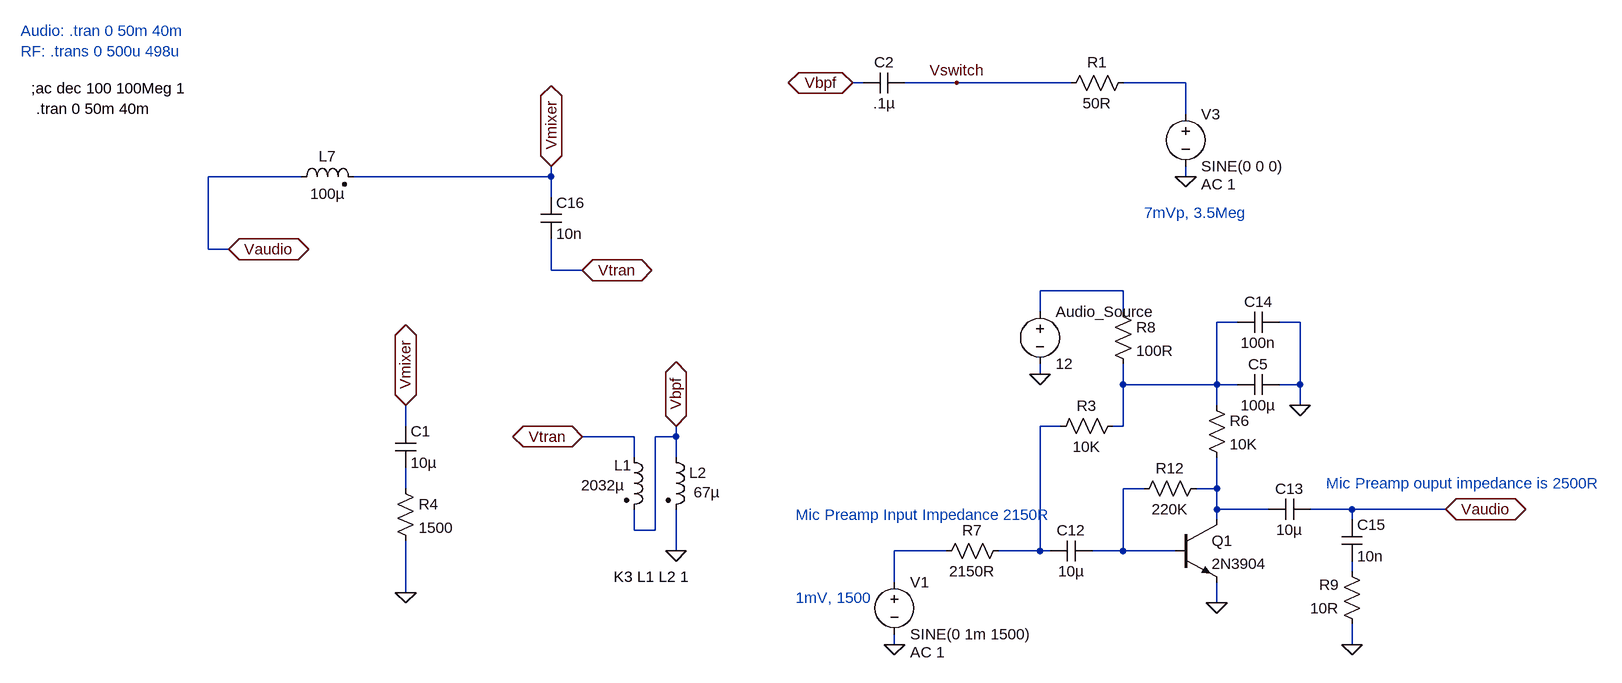
[diagram p0: schematic Receive Chain 80m Passive Switch Test.asc]
Receive Chain 80m Passive Switch Test.asc, the LTspice schematic file:
Version 4
SHEET 1 2548 2196
WIRE 384 112 368 112
WIRE 528 112 448 112
WIRE 704 112 528 112
WIRE 880 112 784 112
WIRE 880 160 880 112
WIRE -480 256 -624 256
WIRE -96 256 -96 240
WIRE -96 256 -400 256
WIRE 880 256 880 240
WIRE -96 288 -96 256
WIRE -624 368 -624 256
WIRE -592 368 -624 368
WIRE -96 400 -96 352
WIRE -48 400 -96 400
WIRE 784 432 656 432
WIRE 656 464 656 432
WIRE 784 464 784 432
WIRE 960 480 928 480
WIRE 1056 480 1024 480
WIRE 656 560 656 544
WIRE 784 576 784 544
WIRE 928 576 928 480
WIRE 928 576 784 576
WIRE 960 576 928 576
WIRE 1056 576 1056 480
WIRE 1056 576 1024 576
WIRE 928 608 928 576
WIRE 1056 608 1056 576
WIRE -320 640 -320 608
WIRE 688 640 656 640
WIRE 784 640 784 576
WIRE 784 640 768 640
WIRE 32 656 -48 656
WIRE 96 656 96 640
WIRE 96 656 64 656
WIRE 32 688 32 656
WIRE 96 688 96 656
WIRE -320 736 -320 704
WIRE 816 736 784 736
WIRE 928 736 928 688
WIRE 928 736 896 736
WIRE 928 768 928 736
WIRE 1008 768 928 768
WIRE 1136 768 1072 768
WIRE 1280 768 1136 768
WIRE 928 784 928 768
WIRE 1136 784 1136 768
WIRE 32 800 32 768
WIRE 64 800 64 656
WIRE 64 800 32 800
WIRE 96 832 96 768
WIRE 512 832 432 832
WIRE 656 832 656 640
WIRE 656 832 592 832
WIRE 672 832 656 832
WIRE 784 832 784 736
WIRE 784 832 736 832
WIRE 864 832 784 832
WIRE 1136 864 1136 848
WIRE 432 880 432 832
WIRE -320 896 -320 816
WIRE 928 912 928 880
WIRE 432 976 432 960
WIRE 1136 976 1136 944
FLAG 96 640 Vbpf
IOPIN 96 640 BiDir
FLAG -320 896 0
FLAG 528 112 Vswitch
FLAG 368 112 Vbpf
IOPIN 368 112 BiDir
FLAG 1280 768 Vaudio
IOPIN 1280 768 BiDir
FLAG 96 832 0
FLAG -592 368 Vaudio
IOPIN -592 368 BiDir
FLAG -320 608 Vmixer
IOPIN -320 608 BiDir
FLAG -96 240 Vmixer
IOPIN -96 240 BiDir
FLAG -48 656 Vtran
IOPIN -48 656 BiDir
FLAG -48 400 Vtran
IOPIN -48 400 BiDir
FLAG 656 560 0
FLAG 432 976 0
FLAG 928 912 0
FLAG 1056 608 0
FLAG 1136 976 0
FLAG 880 256 0
SYMBOL cap 448 96 R90
WINDOW 0 0 32 VBottom 2
WINDOW 3 32 32 VTop 2
SYMATTR InstName C2
SYMATTR Value .1µ
SYMBOL res -336 720 R0
SYMATTR InstName R4
SYMATTR Value 1500
SYMBOL ind2 16 672 R0
WINDOW 0 -15 28 Left 2
WINDOW 3 -66 59 Left 2
SYMATTR InstName L1
SYMATTR Value 2032µ
SYMATTR Type ind
SYMBOL ind2 80 672 R0
WINDOW 3 43 70 Left 2
SYMATTR Value 67µ
SYMATTR InstName L2
SYMATTR Type ind
SYMBOL cap -336 640 R0
SYMATTR InstName C1
SYMATTR Value 10µ
SYMBOL ind2 -496 272 R270
WINDOW 0 32 56 VTop 2
WINDOW 3 5 56 VBottom 2
SYMATTR InstName L7
SYMATTR Value 100µ
SYMATTR Type ind
SYMBOL npn 864 784 R0
SYMATTR InstName Q1
SYMATTR Value 2N3904
SYMBOL res 784 624 R90
WINDOW 0 0 56 VBottom 2
WINDOW 3 32 56 VTop 2
SYMATTR InstName R3
SYMATTR Value 10K
SYMBOL res 912 592 R0
SYMATTR InstName R6
SYMATTR Value 10K
SYMBOL cap 1024 560 R90
WINDOW 0 0 32 VBottom 2
WINDOW 3 32 32 VTop 2
SYMATTR InstName C5
SYMATTR Value 100µ
SYMBOL cap 736 816 R90
WINDOW 0 0 32 VBottom 2
WINDOW 3 32 32 VTop 2
SYMATTR InstName C12
SYMATTR Value 10µ
SYMBOL voltage 432 864 R0
WINDOW 123 24 124 Left 2
WINDOW 39 0 0 Left 2
SYMATTR Value2 AC 1
SYMATTR InstName V1
SYMATTR Value SINE(0 1m 1500)
SYMBOL voltage 656 448 R0
WINDOW 123 0 0 Left 2
WINDOW 39 0 0 Left 2
SYMATTR InstName Audio_Source
SYMATTR Value 12
SYMBOL res 608 816 R90
WINDOW 0 0 56 VBottom 2
WINDOW 3 32 56 VTop 2
SYMATTR InstName R7
SYMATTR Value 2150R
SYMBOL res 768 448 R0
SYMATTR InstName R8
SYMATTR Value 100R
SYMBOL cap 1072 752 R90
WINDOW 0 0 32 VBottom 2
WINDOW 3 32 32 VTop 2
SYMATTR InstName C13
SYMATTR Value 10µ
SYMBOL res 1152 960 R180
WINDOW 0 36 76 Left 2
WINDOW 3 36 40 Left 2
SYMATTR InstName R9
SYMATTR Value 10R
SYMBOL cap 1024 464 R90
WINDOW 0 0 32 VBottom 2
WINDOW 3 32 32 VTop 2
SYMATTR InstName C14
SYMATTR Value 100n
SYMBOL res 912 720 R90
WINDOW 0 0 56 VBottom 2
WINDOW 3 32 56 VTop 2
SYMATTR InstName R12
SYMATTR Value 220K
SYMBOL cap 1120 784 R0
SYMATTR InstName C15
SYMATTR Value 10n
SYMBOL cap -112 288 R0
SYMATTR InstName C16
SYMATTR Value 10n
SYMBOL voltage 880 144 R0
WINDOW 123 24 124 Left 2
WINDOW 39 0 0 Left 2
SYMATTR Value2 AC 1
SYMATTR InstName V3
SYMATTR Value SINE(0 0 0)
SYMBOL res 688 128 R270
WINDOW 0 32 56 VTop 2
WINDOW 3 0 56 VBottom 2
SYMATTR InstName R1
SYMATTR Value 50R
TEXT -888 152 Left 2 !.tran 0 50m 40m
TEXT -896 120 Left 2 !;ac dec 100 100Meg 1
TEXT 0 872 Left 2 !K3 L1 L2 1
TEXT 280 776 Left 2 ;Mic Preamp Input Impedance 2150R
TEXT 1096 728 Left 2 ;Mic Preamp ouput impedance is 2500R
TEXT 280 904 Left 2 ;1mV, 1500
TEXT -912 32 Left 2 ;Audio: .tran 0 50m 40m\nRF: .trans 0 500u 498u
TEXT 816 312 Left 2 ;7mVp, 3.5Meg

The netlist it stands for:
* Receive Chain 80m Passive Switch Test.asc
C2 Vswitch Vbpf .1µ
R4 N005 0 1500
L1 Vtran Vbpf 2032µ
L2 Vbpf 0 67µ
C1 Vmixer N005 10µ
L7 Vaudio Vmixer 100µ
Q1 N007 N006 0 0 2N3904
R3 N003 N004 10K
R6 N003 N007 10K
C5 0 N003 100µ
C12 N006 N004 10µ
V1 N008 0 SINE(0 1m 1500) AC 1
V§Audio_Source N002 0 12
R7 N004 N008 2150R
R8 N002 N003 100R
C13 Vaudio N007 10µ
R9 0 N009 10R
C14 0 N003 100n
R12 N007 N006 220K
C15 Vaudio N009 10n
C16 Vmixer Vtran 10n
V3 N001 0 SINE(0 0 0) AC 1
R1 Vswitch N001 50R
.model NPN NPN
.model PNP PNP
.lib standard.bjt
.tran 0 50m 40m
;ac dec 100 100Meg 1
K3 L1 L2 1
* Mic Preamp Input Impedance 2150R
* Mic Preamp ouput impedance is 2500R
* 1mV, 1500
* Audio: .tran 0 50m 40m
* RF: .trans 0 500u 498u
* 7mVp, 3.5Meg
.backanno
.end